# Altium project NG2093.PrjPcb (part 1 of 10)
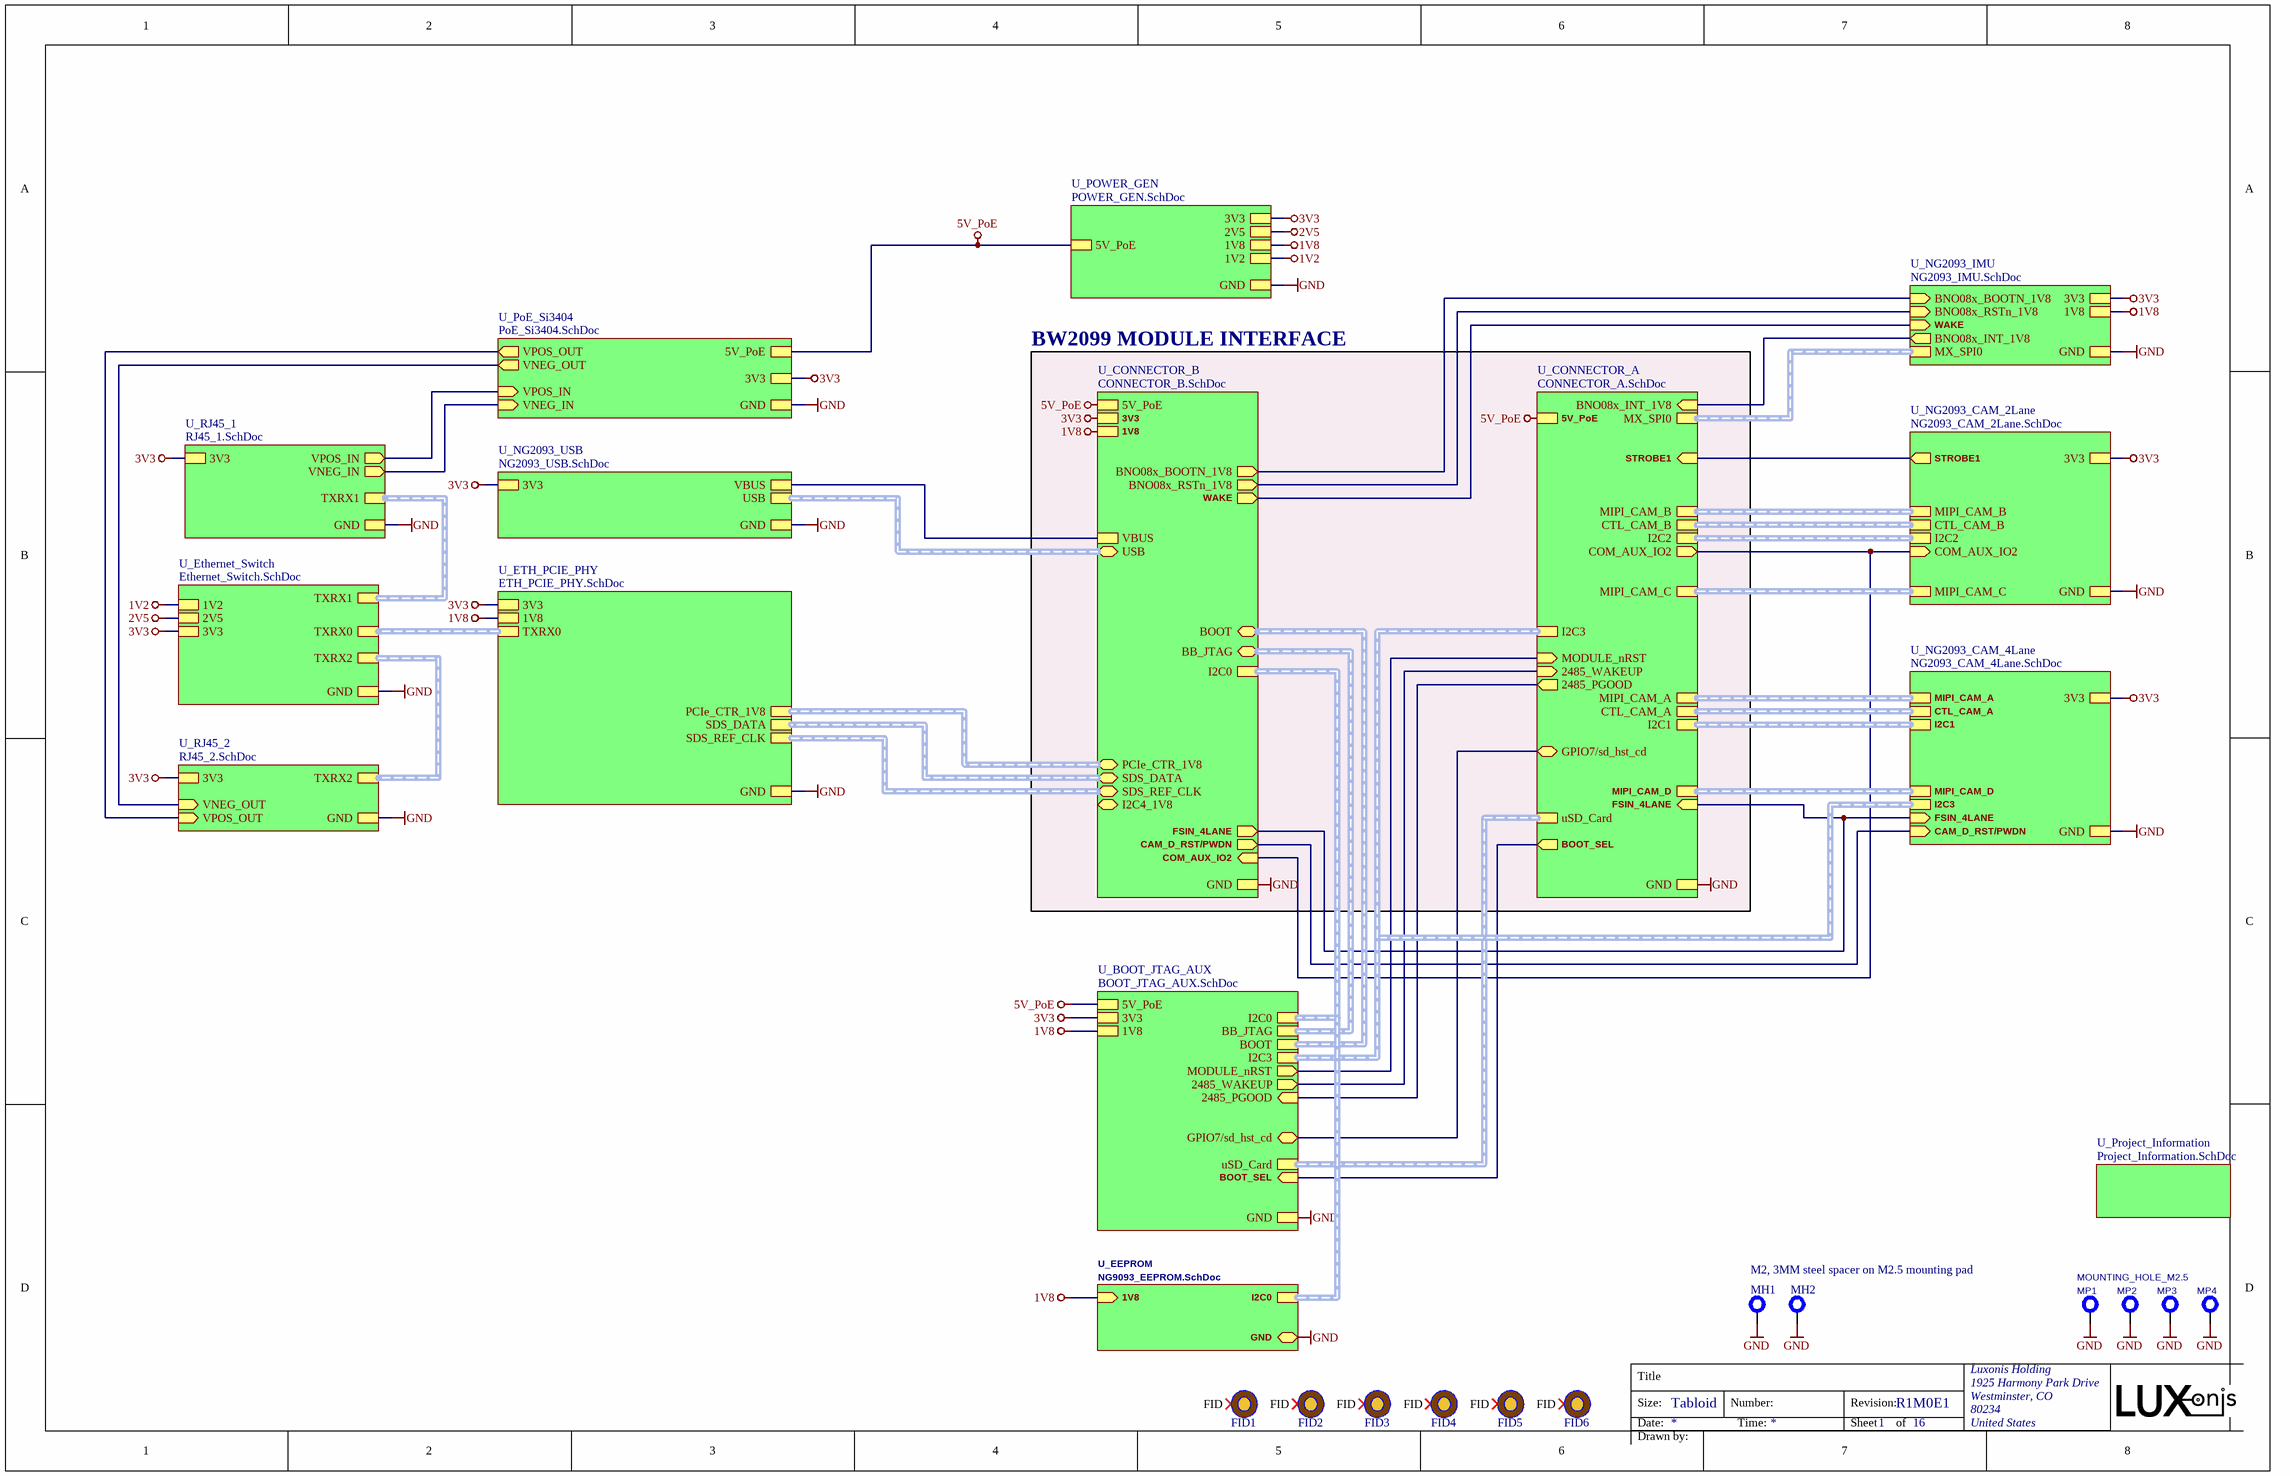
[diagram p0: TopLevel.SchDoc]
drawn_by: Nejc Gostincar; project_title: NG2093; rev: R1M0E1
16 sheets, 379 parts. Net scope: strictly hierarchical (ports join the sheet entries above them; power ports are local).
Board file: NG2093.PcbDoc
Sheets:
  TopLevel.SchDoc
    U_Project_Information = Project_Information.SchDoc
    U_CONNECTOR_B = CONNECTOR_B.SchDoc
    U_CONNECTOR_A = CONNECTOR_A.SchDoc
    U_ETH_PCIE_PHY = ETH_PCIE_PHY.SchDoc
    U_NG2093_USB = NG2093_USB.SchDoc
    U_BOOT_JTAG_AUX = BOOT_JTAG_AUX.SchDoc
    U_POWER_GEN = POWER_GEN.SchDoc
    U_NG2093_IMU = NG2093_IMU.SchDoc
    U_RJ45_1 = RJ45_1.SchDoc
    U_RJ45_2 = RJ45_2.SchDoc
    U_NG2093_CAM_2Lane = NG2093_CAM_2Lane.SchDoc
    U_Ethernet_Switch = Ethernet_Switch.SchDoc
    U_PoE_Si3404 = PoE_Si3404.SchDoc
    U_NG2093_CAM_4Lane = NG2093_CAM_4Lane.SchDoc
    U_EEPROM = NG9093_EEPROM.SchDoc

## Sheet TopLevel.SchDoc: =project_title
size Tabloid; CompanyName: Luxonis Holding; DrawnBy: Nejc Gostincar; Organization: Luxonis Holding; Address1: 1925 Harmony Park Drive; Address2: Westminster, CO; Address3: 80234; Address4: United States; SheetNumber: 1; SheetTotal: 16

### Parts
FID1  FIDUCIAL_ROUND_1MM  [FIDUCIAL_ROUND_1MM]  (value not drawn)  (no BOM)
FID2  FIDUCIAL_ROUND_1MM  [FIDUCIAL_ROUND_1MM]  (value not drawn)  (no BOM)
FID3  FIDUCIAL_ROUND_1MM  [FIDUCIAL_ROUND_1MM]  (value not drawn)  (no BOM)
FID4  FIDUCIAL_ROUND_1MM  [FIDUCIAL_ROUND_1MM]  (value not drawn)  (no BOM)
FID5  FIDUCIAL_ROUND_1MM  [FIDUCIAL_ROUND_1MM]  (value not drawn)  (no BOM)
FID6  FIDUCIAL_ROUND_1MM  [FIDUCIAL_ROUND_1MM]  (value not drawn)  (no BOM)
MH1  M2, 3MM steel spacer on M2.5 mounting pad  [9774030243R]
MH2  M2, 3MM steel spacer on M2.5 mounting pad  [9774030243R]  (value not drawn)
MP1  MOUNTING_HOLE_M2.5  [MOUNTING_HOLE_M2.5]  (no BOM)
MP2  MOUNTING_HOLE_M2.5  [MOUNTING_HOLE_M2.5]  (value not drawn)  (no BOM)
MP3  MOUNTING_HOLE_M2.5  [MOUNTING_HOLE_M2.5]  (value not drawn)  (no BOM)
MP4  MOUNTING_HOLE_M2.5  [MOUNTING_HOLE_M2.5]  (value not drawn)  (no BOM)

### Sub-sheets
U_BOOT_JTAG_AUX = BOOT_JTAG_AUX.SchDoc: BOOT (harness BOOT), BB_JTAG (harness BB_JTAG), uSD_Card (harness uSD_Card), 2485_WAKEUP (out), I2C3 (harness I2C3), MODULE_nRST (out), 2485_PGOOD (in), 1V8, 3V3, GND, 5V_PoE, I2C0 (harness I2C0), GPIO7/sd_hst_cd (bidir), BOOT_SEL (in)
U_CONNECTOR_A = CONNECTOR_A.SchDoc: I2C2 (harness I2C2), I2C1 (harness I2C1), uSD_Card (harness uSD_Card), MIPI_CAM_C (harness MIPI_CAM_C), CTL_CAM_A (harness CTL_CAM_A), MIPI_CAM_A (harness MIPI_CAM_A), MIPI_CAM_B (harness MIPI_CAM_B), GND, I2C3 (harness I2C3), CTL_CAM_B (harness CTL_CAM_B), COM_AUX_IO2 (out), MODULE_nRST (in), 2485_WAKEUP (in), 2485_PGOOD (out), GPIO7/sd_hst_cd (bidir), BNO08x_INT_1V8 (in), MX_SPI0 (harness MX_SPI0), MIPI_CAM_D (harness MIPI_CAM_D), STROBE1 (in), FSIN_4LANE (in), BOOT_SEL (out), 5V_PoE
U_CONNECTOR_B = CONNECTOR_B.SchDoc: VBUS, I2C0 (harness I2C0), 5V_PoE, GND, BOOT (bidir, harness BOOT), PCIe_CTR_1V8 (bidir, harness PCIe_CTR_1V8), BB_JTAG (bidir, harness BB_JTAG), USB (bidir, harness USB), SDS_REF_CLK (bidir, harness SDS_REF_CLK), I2C4_1V8 (bidir, harness I2C4_1V8), SDS_DATA (bidir, harness Harness), BNO08x_BOOTN_1V8 (out), BNO08x_RSTn_1V8 (out), FSIN_4LANE (out), CAM_D_RST/PWDN (out), COM_AUX_IO2 (in), 3V3, 1V8, WAKE (out)
U_EEPROM = NG9093_EEPROM.SchDoc: GND (bidir), 1V8 (in), I2C0 (harness I2C0)
U_ETH_PCIE_PHY = ETH_PCIE_PHY.SchDoc: TXRX0 (harness RTL8111), SDS_DATA (harness Harness), 3V3, GND, SDS_REF_CLK (harness SDS_REF_CLK), 1V8, PCIe_CTR_1V8 (harness PCIe_CTR_1V8)
U_Ethernet_Switch = Ethernet_Switch.SchDoc: TXRX2 (harness RJ45_2), TXRX0 (harness RTL8111), TXRX1 (harness RJ45_1), GND, 3V3, 2V5, 1V2
U_NG2093_CAM_2Lane = NG2093_CAM_2Lane.SchDoc: MIPI_CAM_B (harness MIPI_CAM_B), I2C2 (harness I2C2), MIPI_CAM_C (harness MIPI_CAM_C), GND, 3V3, COM_AUX_IO2 (in), CTL_CAM_B (harness CTL_CAM_B), STROBE1 (out)
U_NG2093_CAM_4Lane = NG2093_CAM_4Lane.SchDoc: GND, 3V3, MIPI_CAM_D (harness MIPI_CAM_D), CTL_CAM_A (harness CTL_CAM_A), MIPI_CAM_A (harness MIPI_CAM_A), CAM_D_RST/PWDN (in), I2C3 (harness I2C3), FSIN_4LANE (in), I2C1 (harness I2C1)
U_NG2093_IMU = NG2093_IMU.SchDoc: BNO08x_BOOTN_1V8 (in), GND, 3V3, BNO08x_INT_1V8 (out), BNO08x_RSTn_1V8 (in), 1V8, MX_SPI0 (harness MX_SPI0), WAKE (in)
U_NG2093_USB = NG2093_USB.SchDoc: USB (harness USB), GND, 3V3, VBUS
U_PoE_Si3404 = PoE_Si3404.SchDoc: 5V_PoE, GND, VPOS_IN (in), VNEG_IN (in), VNEG_OUT (out), VPOS_OUT (out), 3V3
U_POWER_GEN = POWER_GEN.SchDoc: GND, 3V3, 1V8, 5V_PoE, 1V2, 2V5
U_Project_Information = Project_Information.SchDoc: no entries
U_RJ45_1 = RJ45_1.SchDoc: GND, 3V3, VPOS_IN (out), VNEG_IN (out), TXRX1 (harness RJ45_1)
U_RJ45_2 = RJ45_2.SchDoc: GND, 3V3, VNEG_OUT (in), VPOS_OUT (in), TXRX2 (harness RJ45_2)

### Nets
1V2: sheet U_POWER_GEN/1V2, sheet U_Ethernet_Switch/1V2
1V8: sheet U_CONNECTOR_B/1V8, sheet U_ETH_PCIE_PHY/1V8, sheet U_BOOT_JTAG_AUX/1V8, sheet U_POWER_GEN/1V8, sheet U_NG2093_IMU/1V8, sheet U_EEPROM/1V8
2V5: sheet U_POWER_GEN/2V5, sheet U_Ethernet_Switch/2V5
3V3: sheet U_CONNECTOR_B/3V3, sheet U_ETH_PCIE_PHY/3V3, sheet U_NG2093_USB/3V3, sheet U_BOOT_JTAG_AUX/3V3, sheet U_POWER_GEN/3V3, sheet U_NG2093_IMU/3V3, sheet U_RJ45_1/3V3, sheet U_RJ45_2/3V3, sheet U_NG2093_CAM_2Lane/3V3, sheet U_Ethernet_Switch/3V3, sheet U_PoE_Si3404/3V3, sheet U_NG2093_CAM_4Lane/3V3
5V_PoE: sheet U_CONNECTOR_B/5V_PoE, sheet U_CONNECTOR_A/5V_PoE, sheet U_BOOT_JTAG_AUX/5V_PoE, sheet U_POWER_GEN/5V_PoE, sheet U_PoE_Si3404/5V_PoE
GND: MH1.1 MH2.1 MP1.1 MP2.1 MP3.1 MP4.1 ; sheet U_CONNECTOR_B/GND, sheet U_CONNECTOR_A/GND, sheet U_ETH_PCIE_PHY/GND, sheet U_NG2093_USB/GND, sheet U_BOOT_JTAG_AUX/GND, sheet U_POWER_GEN/GND, sheet U_NG2093_IMU/GND, sheet U_RJ45_1/GND, sheet U_RJ45_2/GND, sheet U_NG2093_CAM_2Lane/GND, sheet U_Ethernet_Switch/GND, sheet U_PoE_Si3404/GND, sheet U_NG2093_CAM_4Lane/GND, sheet U_EEPROM/GND
VBUS: sheet U_CONNECTOR_B/VBUS, sheet U_NG2093_USB/VBUS
VNEG_IN: sheet U_RJ45_1/VNEG_IN, sheet U_PoE_Si3404/VNEG_IN
2485_BOOT_SEL: sheet U_CONNECTOR_A/BOOT_SEL, sheet U_BOOT_JTAG_AUX/BOOT_SEL
2485_PGOOD: sheet U_CONNECTOR_A/2485_PGOOD, sheet U_BOOT_JTAG_AUX/2485_PGOOD
2485_WAKEUP: sheet U_CONNECTOR_A/2485_WAKEUP, sheet U_BOOT_JTAG_AUX/2485_WAKEUP
BNO08x_BOOTN_1V8: sheet U_CONNECTOR_B/BNO08x_BOOTN_1V8, sheet U_NG2093_IMU/BNO08x_BOOTN_1V8
BNO08x_INT_1V8: sheet U_CONNECTOR_A/BNO08x_INT_1V8, sheet U_NG2093_IMU/BNO08x_INT_1V8
BNO08x_RSTn_1V8: sheet U_CONNECTOR_B/BNO08x_RSTn_1V8, sheet U_NG2093_IMU/BNO08x_RSTn_1V8
CAM2_RST: sheet U_CONNECTOR_B/CAM_D_RST/PWDN, sheet U_NG2093_CAM_4Lane/CAM_D_RST/PWDN
COM_AUX_IO2: sheet U_CONNECTOR_B/COM_AUX_IO2, sheet U_CONNECTOR_A/COM_AUX_IO2, sheet U_NG2093_CAM_2Lane/COM_AUX_IO2
FSIN_4LANE: sheet U_CONNECTOR_B/FSIN_4LANE, sheet U_CONNECTOR_A/FSIN_4LANE, sheet U_NG2093_CAM_4Lane/FSIN_4LANE
GPIO7/sd_hst_cd: sheet U_CONNECTOR_A/GPIO7/sd_hst_cd, sheet U_BOOT_JTAG_AUX/GPIO7/sd_hst_cd
MODULE_nRST: sheet U_CONNECTOR_A/MODULE_nRST, sheet U_BOOT_JTAG_AUX/MODULE_nRST
STROBE1: sheet U_CONNECTOR_A/STROBE1, sheet U_NG2093_CAM_2Lane/STROBE1
VNEG_OUT: sheet U_RJ45_2/VNEG_OUT, sheet U_PoE_Si3404/VNEG_OUT
VPOS_IN: sheet U_RJ45_1/VPOS_IN, sheet U_PoE_Si3404/VPOS_IN
VPOS_OUT: sheet U_RJ45_2/VPOS_OUT, sheet U_PoE_Si3404/VPOS_OUT
WAKE: sheet U_CONNECTOR_B/WAKE, sheet U_NG2093_IMU/WAKE

Not connected (* = marked no-connect by the designer): FID1 FID*; FID2 FID*; FID3 FID*; FID4 FID*; FID5 FID*; FID6 FID*

### Buses and harness runs
harness sheet U_BOOT_JTAG_AUX/BB_JTAG = sheet U_CONNECTOR_B/BB_JTAG
harness sheet U_BOOT_JTAG_AUX/BOOT = sheet U_CONNECTOR_B/BOOT
harness sheet U_BOOT_JTAG_AUX/I2C0 = sheet U_CONNECTOR_B/I2C0 = sheet U_EEPROM/I2C0
harness sheet U_BOOT_JTAG_AUX/I2C3 = sheet U_CONNECTOR_A/I2C3 = sheet U_NG2093_CAM_4Lane/I2C3
harness sheet U_BOOT_JTAG_AUX/uSD_Card = sheet U_CONNECTOR_A/uSD_Card
harness sheet U_CONNECTOR_A/CTL_CAM_A = sheet U_NG2093_CAM_4Lane/CTL_CAM_A
harness sheet U_CONNECTOR_A/CTL_CAM_B = sheet U_NG2093_CAM_2Lane/CTL_CAM_B
harness sheet U_CONNECTOR_A/I2C1 = sheet U_NG2093_CAM_4Lane/I2C1
harness sheet U_CONNECTOR_A/I2C2 = sheet U_NG2093_CAM_2Lane/I2C2
harness sheet U_CONNECTOR_A/MIPI_CAM_A = sheet U_NG2093_CAM_4Lane/MIPI_CAM_A
harness sheet U_CONNECTOR_A/MIPI_CAM_B = sheet U_NG2093_CAM_2Lane/MIPI_CAM_B
harness sheet U_CONNECTOR_A/MIPI_CAM_C = sheet U_NG2093_CAM_2Lane/MIPI_CAM_C
harness sheet U_CONNECTOR_A/MIPI_CAM_D = sheet U_NG2093_CAM_4Lane/MIPI_CAM_D
harness sheet U_CONNECTOR_A/MX_SPI0 = sheet U_NG2093_IMU/MX_SPI0
harness sheet U_CONNECTOR_B/PCIe_CTR_1V8 = sheet U_ETH_PCIE_PHY/PCIe_CTR_1V8
harness sheet U_CONNECTOR_B/SDS_DATA = sheet U_ETH_PCIE_PHY/SDS_DATA
harness sheet U_CONNECTOR_B/SDS_REF_CLK = sheet U_ETH_PCIE_PHY/SDS_REF_CLK
harness sheet U_CONNECTOR_B/USB = sheet U_NG2093_USB/USB
harness sheet U_ETH_PCIE_PHY/TXRX0 = sheet U_Ethernet_Switch/TXRX0
harness sheet U_Ethernet_Switch/TXRX1 = sheet U_RJ45_1/TXRX1
harness sheet U_Ethernet_Switch/TXRX2 = sheet U_RJ45_2/TXRX2

### Notes on the sheet
- BW2099 MODULE INTERFACE
- Title
- Size:
- Date:
- Tabloid
- Number:
- Time:
- Revision:
- Sheet
- of
- Drawn by:

### Library data of the parts
FID1-FID6 = FIDUCIAL: Fiducial with various available footprints
MH1 MH2 = 9774030243R: MP ROUND STANDOFF M2X0.4 STEEL 3MM; Manufacturer 1: Wurth Electronics; Plating: Tin; Threaded/Unthreaded: Threaded; Outside Diameter: 0.171inch; Supplier 1: Digi-Key; Manufacturer Part Number 1: 9774030243R; Stock 1: 20568; Pricing 1: 1=0.95000, 10=0.91800, 50=0.79500, 100=0.73900 (USD); RoHS: Yes; Material: Steel; Length: 0.173inch; REACH SVHC: Unknown; ComponentLink1URL: http://www.mouser.com/ds/2/445/9774030243R-611455.pdf?src-supplier=Mouser; ComponentLink1Description: http://www.mouser.com/ds/2/445/9774030243R-611455.pdf?src-supplier=Mouser; ComponentLink2URL: http://www.farnell.com/datasheets/1960368.pdf?src-supplier=Farnell; ComponentLink2Description: http://www.farnell.com/datasheets/1960368.pdf?src-supplier=Farnell; ComponentLink3URL: https://katalog.we-online.de/em/datasheet/9774030243R.pdf?src-supplier=Digi-Key; ComponentLink3Description: https://katalog.we-online.de/em/datasheet/9774030243R.pdf?src-supplier=Digi-Key; ComponentLink4URL: http://www.farnell.com/datasheets/1960368.pdf?src-supplier=Newark; ComponentLink4Description: http://www.farnell.com/datasheets/1960368.pdf?src-supplier=Newark; ComponentLink5URL: http://www.farnell.com/datasheets/1960368.pdf?src-supplier=Element14; ComponentLink5Description: http://www.farnell.com/datasheets/1960368.pdf?src-supplier=Element14; Supplier Part Number 1: 732-7085-1-ND; Supplier 2: Mouser; Supplier Part Number 2: 710-9774030243R; Supplier 3: Element14; Supplier Part Number 3: 2497599
MP1-MP4 = MP_Mounting-Holes: =CurrentFootprint; B - Value: Not a Part; A - Level: 0

## Sheet Project_Information.SchDoc: =project_title
size Tabloid; CompanyName: Luxonis Holding; DrawnBy: Nejc Gostincar; Organization: Luxonis Holding; Address1: 1925 Harmony Park Drive; Address2: Westminster, CO; Address3: 80234; Address4: United States; Revision: R1M0E1; SheetNumber: 2; SheetTotal: 16
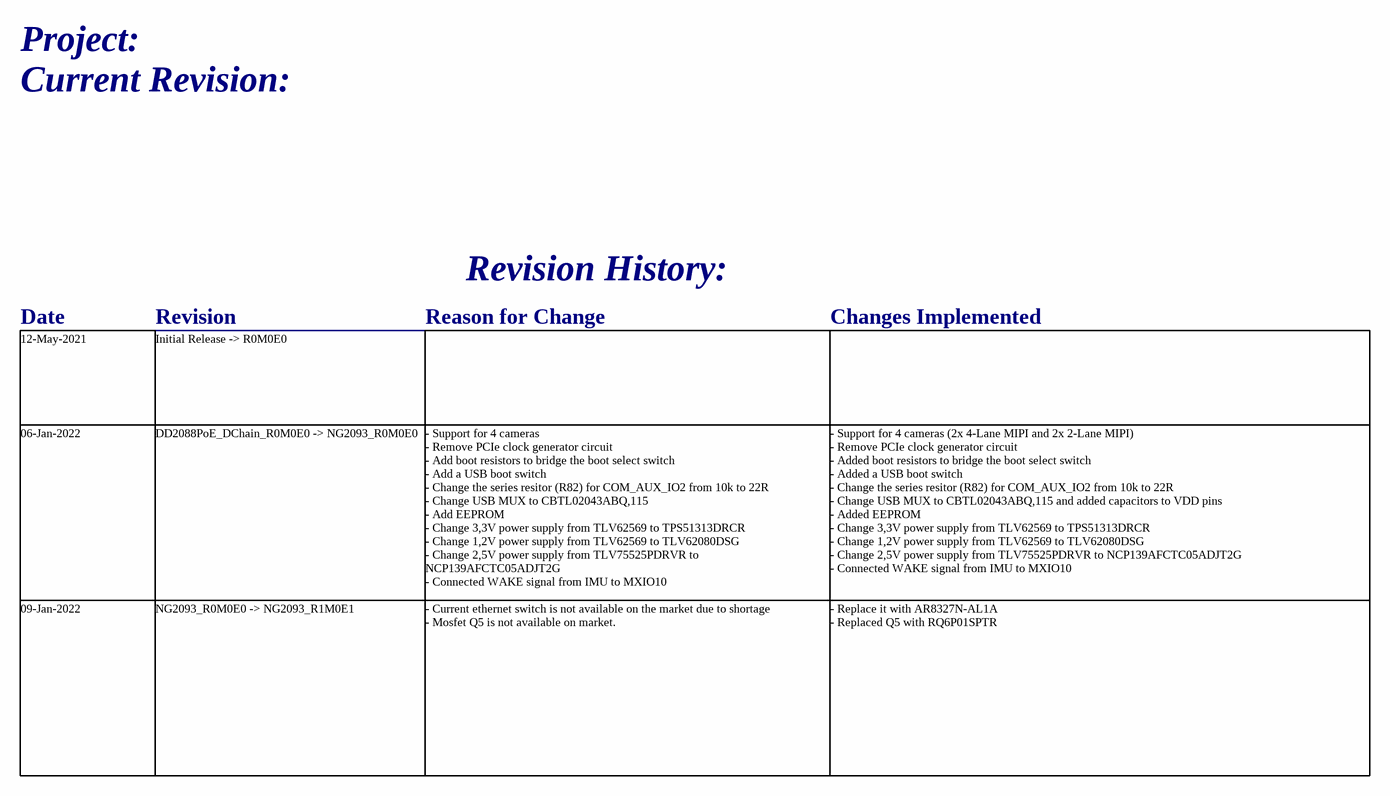
[diagram p1: Project_Information.SchDoc]

### Notes on the sheet
- Project:
- Current Revision:
- Revision History:
- Date
- Revision
- Reason for Change
- Changes Implemented
- 12-May-2021
- Initial Release -> R0M0E0
- 06-Jan-2022
- DD2088PoE_DChain_R0M0E0 -> NG2093_R0M0E0
- - Support for 4 cameras
  - Remove PCIe clock generator circuit
  - Add boot resistors to bridge the boot select switch
  - Add a USB boot switch
  - Change the series resitor (R82) for COM_AUX_IO2 from 10k to 22R
  - Change USB MUX to CBTL02043ABQ,115
  - Add EEPROM
  - Change 3,3V power supply from TLV62569 to TPS51313DRCR
  - Change 1,2V power supply from TLV62569 to TLV62080DSG
  - Change 2,5V power supply from TLV75525PDRVR to NCP139AFCTC05ADJT2G
  - Connected WAKE signal from IMU to MXIO10
- - Support for 4 cameras (2x 4-Lane MIPI and 2x 2-Lane MIPI)
  - Remove PCIe clock generator circuit
  - Added boot resistors to bridge the boot select switch
  - Added a USB boot switch
  - Change the series resitor (R82) for COM_AUX_IO2 from 10k to 22R
  - Change USB MUX to CBTL02043ABQ,115 and added capacitors to VDD pins
  - Added EEPROM
  - Change 3,3V power supply from TLV62569 to TPS51313DRCR
  - Change 1,2V power supply from TLV62569 to TLV62080DSG
  - Change 2,5V power supply from TLV75525PDRVR to NCP139AFCTC05ADJT2G
  - Connected WAKE signal from IMU to MXIO10
- 09-Jan-2022
- NG2093_R0M0E0 -> NG2093_R1M0E1
- - Current ethernet switch is not available on the market due to shortage
  - Mosfet Q5 is not available on market.
- - Replace it with AR8327N-AL1A
  - Replaced Q5 with RQ6P01SPTR
- Title
- Size:
- Date:
- Tabloid
- Number:
- Time:
- Revision:
- Sheet
- of
- Drawn by:

## Sheet CONNECTOR_B.SchDoc: =project_title
size Tabloid; CompanyName: Luxonis Holding; DrawnBy: Nejc Gostincar; Organization: Luxonis Holding; Address1: 1925 Harmony Park Drive; Address2: Westminster, CO; Address3: 80234; Address4: United States; SheetNumber: 5; SheetTotal: 16
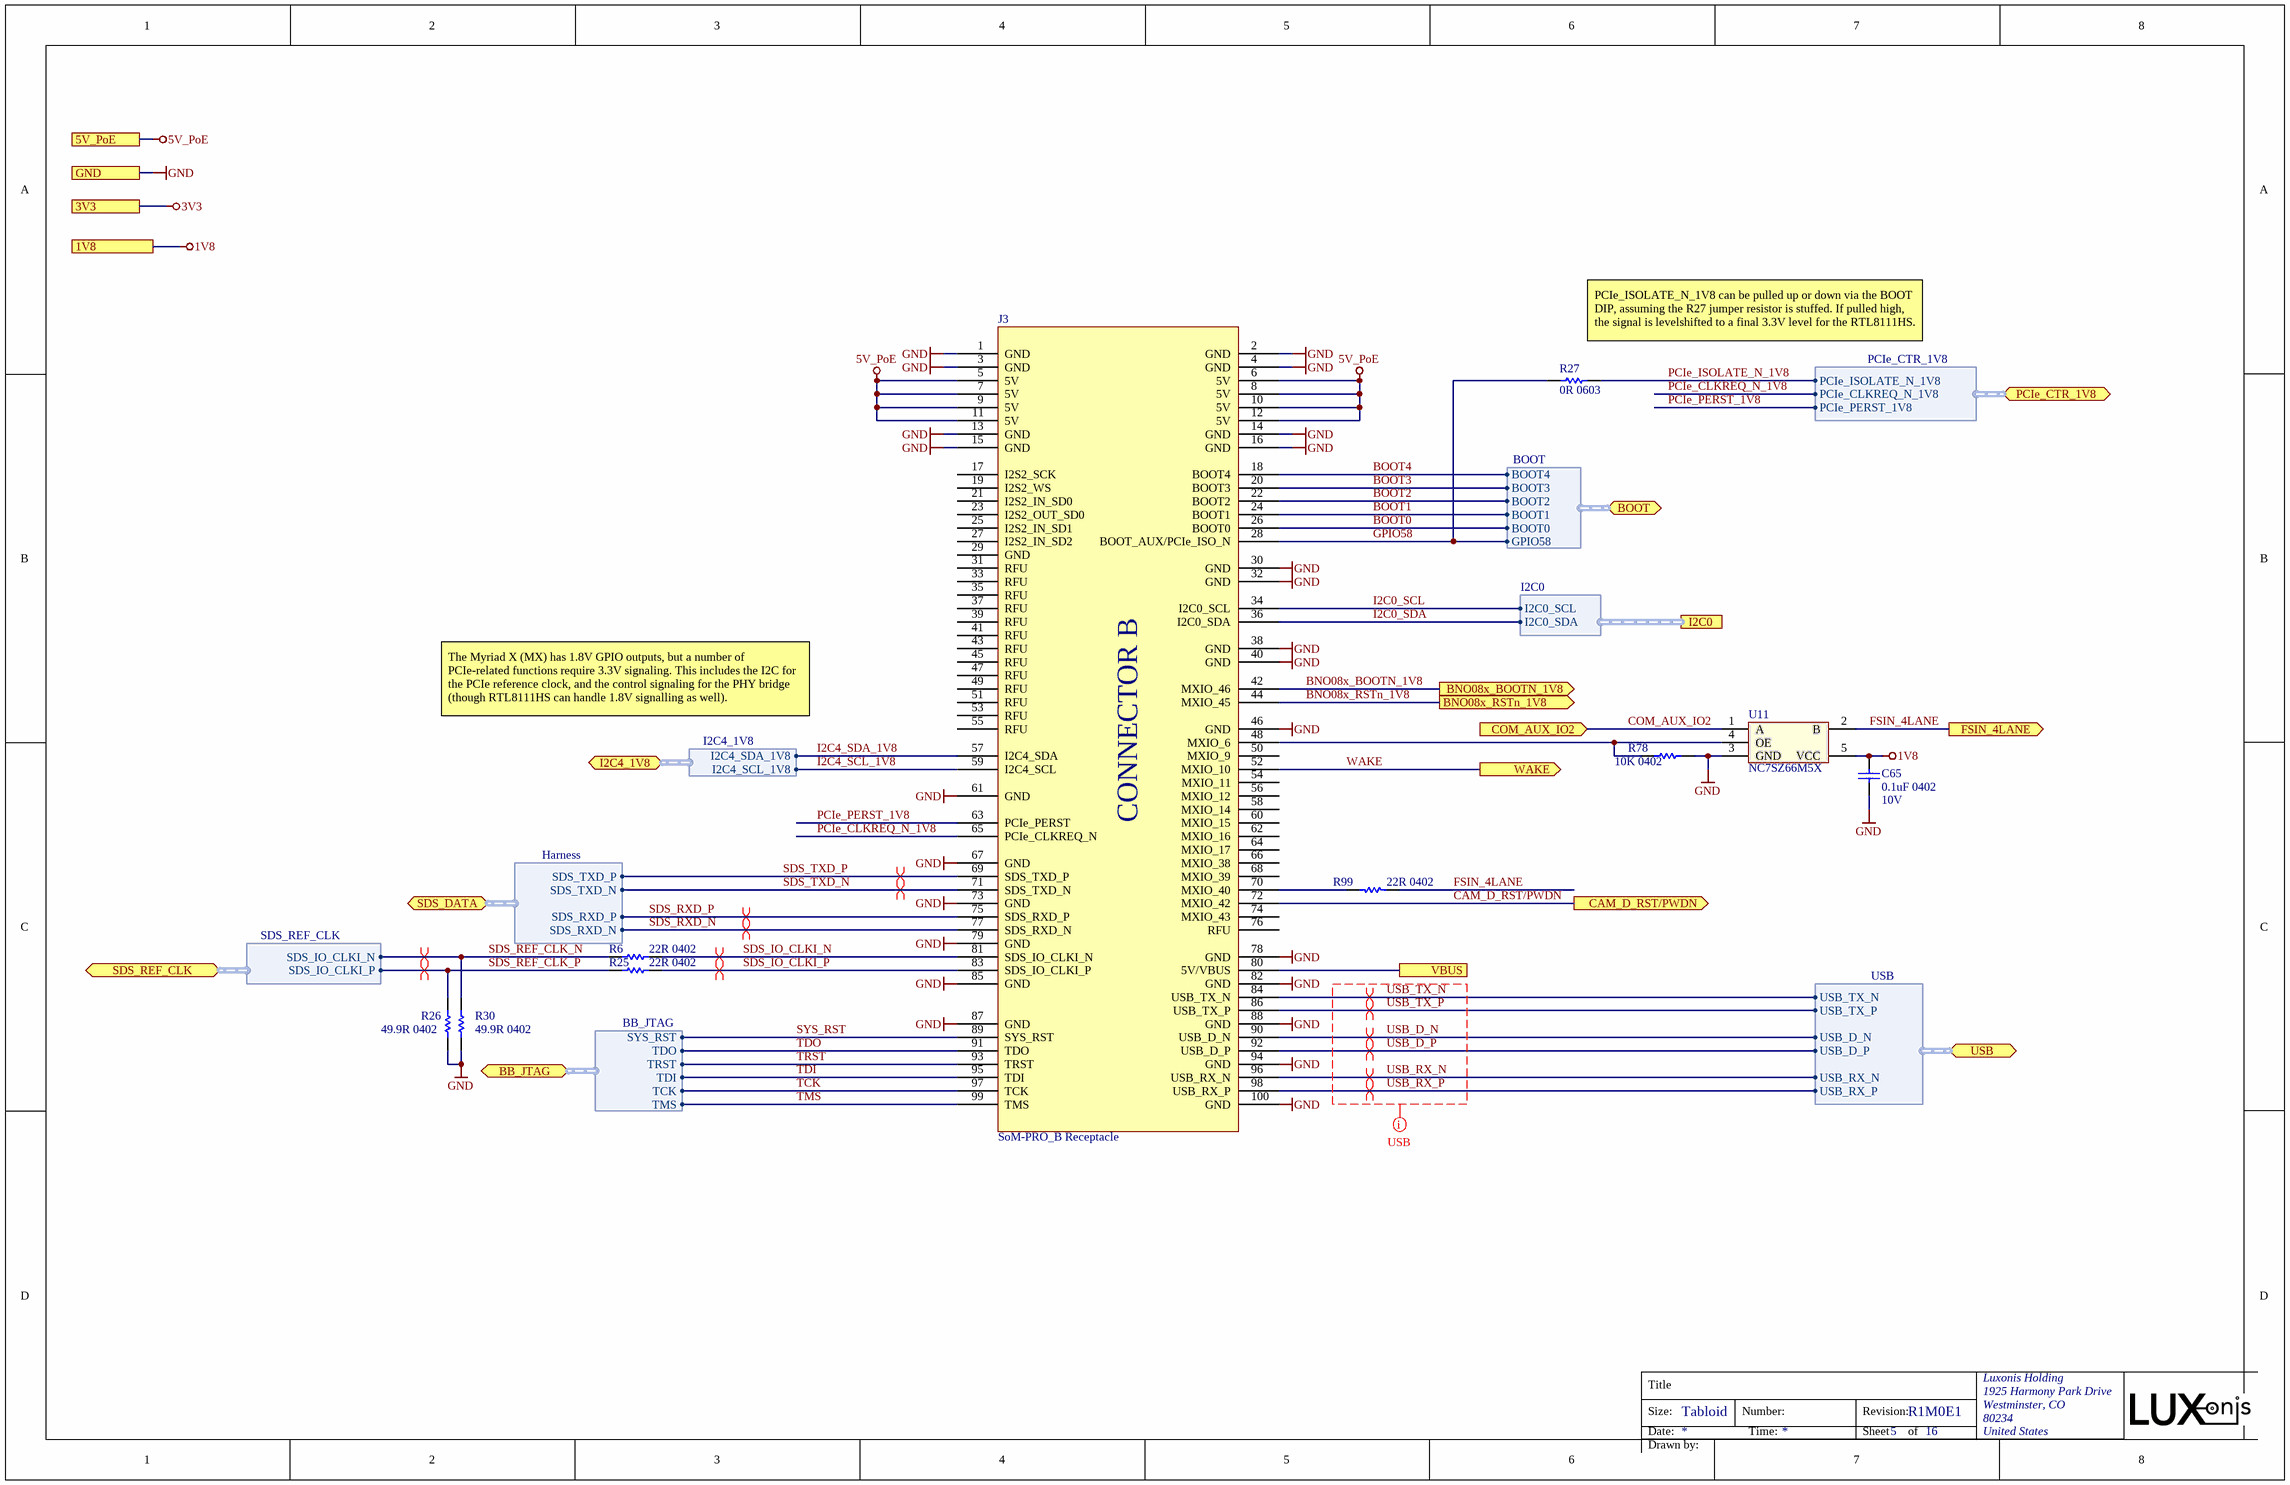
[diagram p2: CONNECTOR_B.SchDoc]

### Parts
C65  0.1uF 0402  Voltage Rating: 10V  [CAPC0402(1005)70_L]
J3  SoM-PRO_B Receptacle  [CON_B_BW2099_SoM_DF40HC-3.0-100DS-0.4V_minpad]
R6  22R 0402  [RESC0402(1005)_L]
R25  22R 0402  [RESC0402(1005)_L]
R26  49.9R 0402  [RESC0402(1005)_L]
R27  0R 0603  [RESC0603(1608)_N]
R30  49.9R 0402  [RESC0402(1005)_L]
R78  10K 0402  [RESC0402(1005)_L]
R99  22R 0402  [RESC0402(1005)_L]
U11  NC7SZ66M5X  [SOT235]

### Ports
1V8, 3V3, 5V_PoE, BB_JTAG (bidir, harness BB_JTAG), BNO08x_BOOTN_1V8 (out), BNO08x_RSTn_1V8 (out), BOOT (bidir, harness BOOT), CAM_D_RST/PWDN (out), COM_AUX_IO2 (in), FSIN_4LANE (out), GND, I2C0 (harness I2C0), I2C4_1V8 (bidir, harness I2C4_1V8), PCIe_CTR_1V8 (bidir, harness PCIe_CTR_1V8), SDS_DATA (bidir, harness Harness), SDS_REF_CLK (bidir, harness SDS_REF_CLK), USB (bidir, harness USB), VBUS, WAKE (out)

### Harnesses
USB: USB_RX_P, USB_RX_N, USB_D_P, USB_D_N, USB_TX_P, USB_TX_N
BOOT: BOOT4, BOOT3, BOOT2, BOOT1, BOOT0, GPIO58
I2C0: I2C0_SDA, I2C0_SCL
BB_JTAG: SYS_RST, TDO, TRST, TDI, TCK, TMS
SDS_REF_CLK: SDS_IO_CLKI_P, SDS_IO_CLKI_N
Harness: SDS_TXD_P, SDS_TXD_N, SDS_RXD_P, SDS_RXD_N
I2C4_1V8: I2C4_SDA_1V8, I2C4_SCL_1V8
PCIe_CTR_1V8: PCIe_CLKREQ_N_1V8, PCIe_ISOLATE_N_1V8, PCIe_PERST_1V8

### Nets
1V8: C65.2 U11.5(VCC) ; port 1V8
5V_PoE: J3.5(5V) J3.6(5V) J3.7(5V) J3.8(5V) J3.9(5V) J3.10(5V) J3.11(5V) J3.12(5V) ; port 5V_PoE
GND: C65.1 J3.1(GND) J3.2(GND) J3.3(GND) J3.4(GND) J3.13(GND) J3.14(GND) J3.15(GND) J3.16(GND) J3.30(GND) J3.32(GND) J3.38(GND) J3.40(GND) J3.46(GND) J3.61(GND) J3.67(GND) J3.73(GND) J3.78(GND) J3.79(GND) J3.82(GND) J3.85(GND) J3.87(GND) J3.88(GND) J3.94(GND) J3.100(GND) R26.1 R30.2 R78.1 U11.3(GND) ; port GND
VBUS: J3.80(5V/VBUS) ; port VBUS
BNO08x_BOOTN_1V8: J3.42(MXIO_46) ; port BNO08x_BOOTN_1V8
BNO08x_RSTn_1V8: J3.44(MXIO_45) ; port BNO08x_RSTn_1V8
BOOT0: J3.26(BOOT0) ; port BOOT.BOOT0
BOOT1: J3.24(BOOT1) ; port BOOT.BOOT1
BOOT2: J3.22(BOOT2) ; port BOOT.BOOT2
BOOT3: J3.20(BOOT3) ; port BOOT.BOOT3
BOOT4: J3.18(BOOT4) ; port BOOT.BOOT4
CAM_D_RST/PWDN: J3.72(MXIO_42) ; port CAM_D_RST/PWDN  [project net CAM2_RST]
COM_AUX_IO2: U11.1(A) ; port COM_AUX_IO2
FSIN_4LANE: R99.1 U11.2(B) ; port FSIN_4LANE
GPIO58: J3.28(BOOT_AUX/PCIe_ISO_N) R27.1 ; port BOOT.GPIO58
I2C0_SCL: J3.34(I2C0_SCL) ; port I2C0.I2C0_SCL
I2C0_SDA: J3.36(I2C0_SDA) ; port I2C0.I2C0_SDA
I2C4_SCL_1V8: J3.59(I2C4_SCL) ; port I2C4_1V8.I2C4_SCL_1V8
I2C4_SDA_1V8: J3.57(I2C4_SDA) ; port I2C4_1V8.I2C4_SDA_1V8
PCIe_CLKREQ_N_1V8: J3.65(PCIe_CLKREQ_N) ; port PCIe_CTR_1V8.PCIe_CLKREQ_N_1V8
PCIe_ISOLATE_N_1V8: R27.2 ; port PCIe_CTR_1V8.PCIe_ISOLATE_N_1V8
PCIe_PERST_1V8: J3.63(PCIe_PERST) ; port PCIe_CTR_1V8.PCIe_PERST_1V8
SDS_IO_CLKI_N: J3.81(SDS_IO_CLKI_N) R6.2
SDS_IO_CLKI_P: J3.83(SDS_IO_CLKI_P) R25.2
SDS_REF_CLK_N: R6.1 R30.1 ; port SDS_REF_CLK.SDS_IO_CLKI_N
SDS_REF_CLK_P: R25.1 R26.2 ; port SDS_REF_CLK.SDS_IO_CLKI_P
SDS_RXD_N: J3.77(SDS_RXD_N) ; port SDS_DATA.SDS_RXD_N
SDS_RXD_P: J3.75(SDS_RXD_P) ; port SDS_DATA.SDS_RXD_P
SDS_TXD_N: J3.71(SDS_TXD_N) ; port SDS_DATA.SDS_TXD_N
SDS_TXD_P: J3.69(SDS_TXD_P) ; port SDS_DATA.SDS_TXD_P
SYS_RST: J3.89(SYS_RST) ; port BB_JTAG.SYS_RST
TCK: J3.97(TCK) ; port BB_JTAG.TCK
TDI: J3.95(TDI) ; port BB_JTAG.TDI
TDO: J3.91(TDO) ; port BB_JTAG.TDO
TMS: J3.99(TMS) ; port BB_JTAG.TMS
TRST: J3.93(TRST) ; port BB_JTAG.TRST
USB_D_N: J3.90(USB_D_N) ; port USB.USB_D_N
USB_D_P: J3.92(USB_D_P) ; port USB.USB_D_P
USB_RX_N: J3.96(USB_RX_N) ; port USB.USB_RX_N
USB_RX_P: J3.98(USB_RX_P) ; port USB.USB_RX_P
USB_TX_N: J3.84(USB_TX_N) ; port USB.USB_TX_N
USB_TX_P: J3.86(USB_TX_P) ; port USB.USB_TX_P
WAKE: J3.52(MXIO_10) ; port WAKE
NetJ3_48: J3.48(MXIO_6) R78.2 U11.4(OE)
NetJ3_70: J3.70(MXIO_40) R99.2

Not connected (* = marked no-connect by the designer): J3 17(I2S2_SCK) 19(I2S2_WS) 21(I2S2_IN_SD0) 23(I2S2_OUT_SD0) 25(I2S2_IN_SD1) 27(I2S2_IN_SD2) 29(GND) 31(RFU) 33(RFU) 35(RFU) 37(RFU) 39(RFU) 41(RFU) 43(RFU) 45(RFU) 47(RFU) 49(RFU) 50(MXIO_9) 51(RFU) 53(RFU) 54(MXIO_11) 55(RFU) 56(MXIO_12) 58(MXIO_14) 60(MXIO_15) 62(MXIO_16) 64(MXIO_17) 66(MXIO_38) 68(MXIO_39) 74(MXIO_43) 76(RFU)

### Layout directives
net class USB: USB_D_N, USB_D_P, USB_RX_N, USB_RX_P, USB_TX_N, USB_TX_P
differential pair; differential pair class 100ohm: SDS_IO_CLKI_N, SDS_IO_CLKI_P, SDS_REF_CLK_N, SDS_REF_CLK_P, SDS_RXD_N, SDS_RXD_P, SDS_TXD_N, SDS_TXD_P
differential pair; differential pair class USB3: USB_D_N, USB_D_P, USB_RX_N, USB_RX_P, USB_TX_N, USB_TX_P

### Notes on the sheet
- PCIe_ISOLATE_N is wired up on the MV0247 via GPIO58, but does not exist in the MV0235 design.
- (near R27) PCIe_ISOLATE_N_1V8 can be pulled up or down via the BOOT DIP, assuming the R27 jumper resistor is stuffed. If pulled high, the signal is levelshifted to a final 3.3V level for the RTL8111HS.
- The Myriad X (MX) has 1.8V GPIO outputs, but a number of PCIe-related functions require 3.3V signaling. This includes the I2C for the PCIe reference clock, and the control signaling for the PHY bridge (though RTL8111HS can handle 1.8V signalling as well).
- Title
- Size:
- Date:
- Tabloid
- Number:
- Time:
- Revision:
- Sheet
- of
- Drawn by:
- (in symbol DF40HC(3.0)-100DS-0.4V_SoM-PRO_B) CONNECTOR B

### Library data of the parts
C65 = GRM155R71A104JA01D: CAP CER 0.1UF 10V X7R 0402 5%; Manufacturer 1: Murata; Capacitance: 100nF; Supplier 1: Digi-Key; Manufacturer Part Number 1: GRM155R71A104JA01D; Stock 1: 1346709; Pricing 1: 1=0.10000, 10=0.02500, 100=0.01130, 500=0.00806, 1000=0.00633, 2500=0.00575, 5000=0.00529 (USD); RoHS: Yes; Mount: Surface Mount; Case/Package: 0402; Case Code (Imperial): 0402; Case Code (Metric): 1005; Min Operating Temperature: -55°C; Max Operating Temperature: 125°C; Tolerance: 5%; Packaging: Tape and Reel; Voltage Rating (DC): 10V; Dielectric: X7R; Package Quantity: 10000; Termination: SMD/SMT; Length: 1mm; Height: 0.5mm; Width: 0.02inch; Thickness: 0.022inch; Depth: 0.5mm; Radiation Hardening: No; Lead Free: Lead Free; ComponentLink1URL: https://datasheet.ciiva.com/5411/product-5411135.pdf?src-supplier=Mouser; ComponentLink1Description: https://datasheet.ciiva.com/5411/product-5411135.pdf?src-supplier=Mouser; ComponentLink2URL: https://datasheet.ciiva.com/11618/c02e-11618821.pdf?src-supplier=Avnet; ComponentLink2Description: https://datasheet.ciiva.com/11618/c02e-11618821.pdf?src-supplier=Avnet; Supplier Part Number 1: 490-10777-1-ND
J3 = DF40HC(3.0)-100DS-0.4V_SoM-PRO_B: CONN RCPT 100POS 0.4MM SMD GOLD; Manufacturer 1: Hirose; Manufacturer Part Number 1: DF40HC(3.0)-100DS-0.4V(58); Number of Positions: 100; Pitch: 0.016inch; System: Connector; RoHS: Yes; Mount: Surface Mount; Contact Plating: Gold; Packaging: Tape and Reel; Number of Rows: 2; Package Quantity: 1000; Connector Type: Receptacle; Lead Free: Lead Free; ComponentLink1URL: https://datasheet.ciiva.com/46636/ed-df40-20140305-46636517.pdf?src-supplier=Digi-Key; ComponentLink1Description: https://datasheet.ciiva.com/46636/ed-df40-20140305-46636517.pdf?src-supplier=Digi-Key; ComponentLink2URL: https://datasheet.ciiva.com/18562/ed-df40-20140305-18562189.pdf?src-supplier=Digi-Key; ComponentLink2Description: https://datasheet.ciiva.com/18562/ed-df40-20140305-18562189.pdf?src-supplier=Digi-Key; ComponentLink3URL: https://datasheet.ciiva.com/13559/ed-df40-20140305-13559540.pdf?src-supplier=Mouser; ComponentLink3Description: https://datasheet.ciiva.com/13559/ed-df40-20140305-13559540.pdf?src-supplier=Mouser; ComponentLink4URL: https://datasheet.ciiva.com/18562/ed-df40-20140305-18562462.pdf?src-supplier=Digi-Key; ComponentLink4Description: https://datasheet.ciiva.com/18562/ed-df40-20140305-18562462.pdf?src-supplier=Digi-Key; Supplier 1: Mouser; Stock 1: 2172; Pricing 1: 1=2.54000, 10=2.26000, 25=2.07000, 50=2.07000, 100=1.98000, 250=1.79000, 500=1.65000, 1000=1.41000, 3000=1.32000, 6000=1.23000, 10000=1.23000 (USD); Supplier 2: Mouser; Stock 2: 2078; Pricing 2: 1=2.50000, 10=2.40000, 25=2.10000, 50=2.10000, 100=2.00000, 250=1.76000, 500=1.71000, 1000=1.45000, 2000=1.36000, 5000=1.31000, 10000=1.31000 (USD); Supplier Part Number 1: 798-DF40HC30100DS451; Supplier Part Number 2: 798-DF40HC30100DS458
R6 R25 R99 = RC0402FR-0722RL: RES SMD 22 OHM 1% 1/16W 0402; Manufacturer 1: Yageo; Temperature Coefficient: 100ppm/°C; Power Rating: 63mW; Voltage Rating: 50V; Supplier 1: Digi-Key; Manufacturer Part Number 1: RC0402FR-0722RL; Stock 1: 23751364; Pricing 1: 10000=0.00163, 30000=0.00144, 50000=0.00132, 100000=0.00129 (USD); RoHS: Yes; Case/Package: 0402; Number of Pins: 2; Case Code (Metric): 1005; Case Code (Imperial): 0402; Min Operating Temperature: -55°C; Max Operating Temperature: 155°C; Tolerance: 1%; Resistance: 22R; Packaging: Tape and Reel; Composition: Thick Film; Voltage Rating (DC): 50V; Termination: SMD/SMT; Military Standard: Not; Length: 1mm; Height: 0.32mm; Width: 0.5mm; Depth: 0.5mm; REACH SVHC: Unknown; Lead Free: Lead Free; ComponentLink1URL: https://datasheet.ciiva.com/11819/0900766b80c66297-11819462.pdf?src-supplier=RSComponents; ComponentLink1Description: https://datasheet.ciiva.com/11819/0900766b80c66297-11819462.pdf?src-supplier=RSComponents; ComponentLink2URL: https://datasheet.ciiva.com/7849/1018594-7849911.pdf?src-supplier=Element14; ComponentLink2Description: https://datasheet.ciiva.com/7849/1018594-7849911.pdf?src-supplier=Element14; ComponentLink3URL: https://datasheet.ciiva.com/26829/getdatasheetpartid-554995-26829991.pdf?src-supplier=Verical; ComponentLink3Description: https://datasheet.ciiva.com/26829/getdatasheetpartid-554995-26829991.pdf?src-supplier=Verical; ComponentLink4URL: https://datasheet.ciiva.com/7849/1018594-7849912.pdf?src-supplier=Element14; ComponentLink4Description: https://datasheet.ciiva.com/7849/1018594-7849912.pdf?src-supplier=Element14; ComponentLink5URL: https://datasheet.ciiva.com/16930/pyu-rc0402-51-rohs-l-6-r-16930687.pdf?src-supplier=Future+Electronics; ComponentLink5Description: https://datasheet.ciiva.com/16930/pyu-rc0402-51-rohs-l-6-r-16930687.pdf?src-supplier=Future+Electronics; Supplier 2: Newark; Supplier 3: Mouser; Supplier Part Number 2: 26M6784; Supplier Part Number 3: 603-RC0402FR-0722RL; Supplier Part Number 1: 311-22.0LRTR-ND
R26 R30 = RC0402FR-0749R9L: RES SMD 49.9 OHM 1% 1/16W 0402; Manufacturer 1: Yageo; Power Rating: 62.5mW; Temperature Coefficient: 100ppm/°C; Voltage Rating: 50V; Max Power Dissipation: 63mW; Supplier 1: Digi-Key; Manufacturer Part Number 1: RC0402FR-0749R9L; Stock 1: 15110719; Pricing 1: 1=0.10000, 10=0.01600, 100=0.00640, 1000=0.00289, 2500=0.00251, 5000=0.00207 (USD); RoHS: Yes; Case/Package: 0402; Number of Pins: 2; Case Code (Imperial): 0402; Case Code (Metric): 1005; Min Operating Temperature: -55°C; Max Operating Temperature: 155°C; Packaging: Tape and Reel; Resistance: 49.9R; Tolerance: 1%; Composition: Thick Film; Number of Terminations: 2; Package Quantity: 1; Termination: SMD/SMT; Military Standard: Not; Voltage Rating (DC): 50V; Features: Moisture Resistant; Working Voltage: 50V; Length: 1mm; Height: 0.016inch; Width: 0.5mm; Depth: 0.5mm; Lead Free: Lead Free; REACH SVHC: No SVHC; ComponentLink1URL: https://datasheet.ciiva.com/11819/0900766b80c66297-11819508.pdf?src-supplier=RSComponents; ComponentLink1Description: https://datasheet.ciiva.com/11819/0900766b80c66297-11819508.pdf?src-supplier=RSComponents; ComponentLink2URL: https://datasheet.ciiva.com/7983/1018594-7983542.pdf?src-supplier=Element14; ComponentLink2Description: https://datasheet.ciiva.com/7983/1018594-7983542.pdf?src-supplier=Element14; ComponentLink3URL: https://datasheet.ciiva.com/16743/pyu-rc0402-51-rohs-l-6-r-16743942.pdf?src-supplier=Future+Electronics; ComponentLink3Description: https://datasheet.ciiva.com/16743/pyu-rc0402-51-rohs-l-6-r-16743942.pdf?src-supplier=Future+Electronics; ComponentLink4URL: https://datasheet.ciiva.com/22747/1018594-22747514.pdf?src-supplier=Element14; ComponentLink4Description: https://datasheet.ciiva.com/22747/1018594-22747514.pdf?src-supplier=Element14; ComponentLink5URL: https://datasheet.ciiva.com/2453/pyu-r-int-thick-7-2453355.pdf?src-supplier=Digi-Key; ComponentLink5Description: https://datasheet.ciiva.com/2453/pyu-r-int-thick-7-2453355.pdf?src-supplier=Digi-Key; ComponentLink6URL: https://datasheet.ciiva.com/2453/pyu-r-int-thick-7-2453356.pdf?src-supplier=Digi-Key; ComponentLink6Description: https://datasheet.ciiva.com/2453/pyu-r-int-thick-7-2453356.pdf?src-supplier=Digi-Key; ComponentLink7URL: https://datasheet.ciiva.com/2453/pyu-r-int-thick-7-2453357.pdf?src-supplier=Digi-Key; ComponentLink7Description: https://datasheet.ciiva.com/2453/pyu-r-int-thick-7-2453357.pdf?src-supplier=Digi-Key; Supplier 2: Mouser; Supplier Part Number 1: 311-49.9LRCT-ND; Supplier Part Number 2: 603-RC0402FR-0749R9L
R27 = CRCW06030000Z0EA: RES SMD 0 OHM JUMPER 1/10W 0603 0 Ohms Jumper 0.1W, 1/10W Chip Resistor 0603 (1608 Metric) Automotive AEC-Q200 Thick Film; Manufacturer 1: Vishay; Manufacturer Part Number 1: CRCW0603-0000Z0EA; Resistance: 0mR; Power Rating: 100mW; Voltage Rating: 75V; Temperature Coefficient: 100ppm/°C; Tolerance: 5%; Current Rating: 2A; Supplier 1: Digi-Key; Stock 1: 742743; Pricing 1: 1=0.100000, 10=0.034000, 25=0.024400, 50=0.018600, 100=0.013800, 250=0.010480, 500=0.008400, 1000=0.006180 (USD); RoHS: Yes; Mount: Surface Mount; Case/Package: 0603; Weight: 7.1E-05oz; Contact Plating: Tin,Lead; Case Code (Metric): 1608; Case Code (Imperial): 0603; Min Operating Temperature: -55°C; Max Operating Temperature: 155°C; Composition: Thick Film; Termination: SMD/SMT; Packaging: Tape and Reel; Package Quantity: 1; Number of Terminations: 2; Military Standard: Not; Max Power Dissipation: 100mW; Voltage Rating (DC): 75V; Features: Automotive AEC-Q200; Working Voltage: 75V; Length: 1.55mm; Height: 0.02inch; Width: 0.033inch; Depth: 0.85mm; Radiation Hardening: No; Lead Free: Lead Free; REACH SVHC: Unknown; ComponentLink1URL: https://datasheet.ciiva.com/2461/dcrcwe3-2461968.pdf?src-supplier=Digi-Key; ComponentLink1Description: https://datasheet.ciiva.com/2461/dcrcwe3-2461968.pdf?src-supplier=Digi-Key; ComponentLink2URL: https://datasheet.ciiva.com/2461/dcrcwe3-2461969.pdf?src-supplier=Digi-Key; ComponentLink2Description: https://datasheet.ciiva.com/2461/dcrcwe3-2461969.pdf?src-supplier=Digi-Key; ComponentLink3URL: https://datasheet.ciiva.com/2461/dcrcwe3-2461970.pdf?src-supplier=Digi-Key; ComponentLink3Description: https://datasheet.ciiva.com/2461/dcrcwe3-2461970.pdf?src-supplier=Digi-Key; ComponentLink4URL: https://datasheet.ciiva.com/8340/dcrcwe3-8340197.pdf?src-supplier=Avnet; ComponentLink4Description: https://datasheet.ciiva.com/8340/dcrcwe3-8340197.pdf?src-supplier=Avnet; ComponentLink5URL: https://datasheet.ciiva.com/16941/dcrcw-16941302.pdf?src-supplier=Avnet+Europe; ComponentLink5Description: https://datasheet.ciiva.com/16941/dcrcw-16941302.pdf?src-supplier=Avnet+Europe; ComponentLink6URL: https://datasheet.ciiva.com/16199/dcrcwe3-16199063.pdf?src-supplier=Future+Electronics; ComponentLink6Description: https://datasheet.ciiva.com/16199/dcrcwe3-16199063.pdf?src-supplier=Future+Electronics; ComponentLink7URL: https://datasheet.ciiva.com/16725/70201119-16725175.pdf?src-supplier=Allied+Electronics; ComponentLink7Description: https://datasheet.ciiva.com/16725/70201119-16725175.pdf?src-supplier=Allied+Electronics; ComponentLink8URL: https://datasheet.ciiva.com/26316/fld-crcw-e3-data-en-26316615.pdf?src-supplier=Distrelec; ComponentLink8Description: https://datasheet.ciiva.com/26316/fld-crcw-e3-data-en-26316615.pdf?src-supplier=Distrelec; ComponentLink9URL: https://datasheet.ciiva.com/5544/dcrcwe3-109170-5544344.pdf?src-supplier=Mouser; ComponentLink9Description: https://datasheet.ciiva.com/5544/dcrcwe3-109170-5544344.pdf?src-supplier=Mouser; ComponentLink10URL: https://datasheet.ciiva.com/7841/1720486-7841816.pdf?src-supplier=Element14; ComponentLink10Description: https://datasheet.ciiva.com/7841/1720486-7841816.pdf?src-supplier=Element14; ComponentLink11URL: https://datasheet.ciiva.com/7841/1720486-7841817.pdf?src-supplier=Element14; ComponentLink11Description: https://datasheet.ciiva.com/7841/1720486-7841817.pdf?src-supplier=Element14; ComponentLink12URL: https://datasheet.ciiva.com/7841/125364-7841818.pdf?src-supplier=Element14; ComponentLink12Description: https://datasheet.ciiva.com/7841/125364-7841818.pdf?src-supplier=Element14; ComponentLink13URL: https://datasheet.ciiva.com/16721/70201119-16721450.pdf?src-supplier=Allied+Electronics; ComponentLink13Description: https://datasheet.ciiva.com/16721/70201119-16721450.pdf?src-supplier=Allied+Electronics; Supplier Part Number 1: 541-0.0GCT-ND
R78 = RC0402FR-1310KL: RES SMD 10K OHM 1% 0402 1/16W Chip Resistor, 0402 [1005 Metric], 10 kohm, RC Series, 50 V, Thick Film, 62.5 mW; Manufacturer 1: Yageo; Resistance: 10kR; Temperature Coefficient: 100ppm/°C; Power Rating: 62.5mW; Voltage Rating: 50V; ComponentLink1URL: https://datasheet.ciiva.com/16940/pyu-rc0402-51-rohs-l-6-16940293.pdf?src-supplier=Avnet+Europe; ComponentLink1Description: https://datasheet.ciiva.com/16940/pyu-rc0402-51-rohs-l-6-16940293.pdf?src-supplier=Avnet+Europe; ComponentLink2URL: https://datasheet.ciiva.com/28386/pyu-rc0402-51-rohs-l-6-28386855.pdf?src-supplier=Avnet+Europe; ComponentLink2Description: https://datasheet.ciiva.com/28386/pyu-rc0402-51-rohs-l-6-28386855.pdf?src-supplier=Avnet+Europe; ComponentLink3URL: https://datasheet.ciiva.com/16740/pyu-rc0402-51-rohs-l-6-r-16740602.pdf?src-supplier=Future+Electronics; ComponentLink3Description: https://datasheet.ciiva.com/16740/pyu-rc0402-51-rohs-l-6-r-16740602.pdf?src-supplier=Future+Electronics; ComponentLink4URL: https://datasheet.ciiva.com/8891/pyu-rc0402-51-rohs-l-6-8891339.pdf?src-supplier=Avnet; ComponentLink4Description: https://datasheet.ciiva.com/8891/pyu-rc0402-51-rohs-l-6-8891339.pdf?src-supplier=Avnet; ComponentLink5URL: https://datasheet.ciiva.com/5557/pyu-rc0402-51-rohs-l-6-r-5557997.pdf?src-supplier=Mouser; ComponentLink5Description: https://datasheet.ciiva.com/5557/pyu-rc0402-51-rohs-l-6-r-5557997.pdf?src-supplier=Mouser; ComponentLink6URL: https://datasheet.ciiva.com/7983/1018594-7983533.pdf?src-supplier=Element14; ComponentLink6Description: https://datasheet.ciiva.com/7983/1018594-7983533.pdf?src-supplier=Element14; Supplier 1: Newark; Manufacturer Part Number 1: RC0402FR-1310KL; Stock 1: 62239; Pricing 1: 1=0.10000, 25=0.01200, 100=0.00400, 250=0.00400, 500=0.00300, 1000=0.00300 (USD); RoHS: Yes; Case/Package: 0402; Number of Pins: 2; Contact Plating: Tin,Matte,Lead; Case Code (Imperial): 0402; Case Code (Metric): 1005; Min Operating Temperature: -55°C; Max Operating Temperature: 155°C; Tolerance: 1%; Composition: Thick Film; Packaging: Tape and Reel; Termination: SMD/SMT; Military Standard: Not; Voltage Rating (DC): 50V; Working Voltage: 50V; Number of Terminations: 2; Length: 1mm; Depth: 0.5mm; Radiation Hardening: No; REACH SVHC: No SVHC; Lead Free: Lead Free; Supplier Part Number 1: 67R9960; Supplier 2: Future Electronics; Supplier 3: Mouser; Supplier 4: Element14; Supplier Part Number 2: RC0402FR-1310KL-CUTT; Supplier Part Number 3: 603-RC0402FR-1310KL; Supplier Part Number 4: 1799235
U11 = NC7SZ66M5X: ANALOGUE SWITCH, SINGLE, SPST-NO, SOT-23; Analog Switch Type:SPST - NO; No. of Channels:1; On State Resistance Max:60ohm; Supply Voltage Range:1.65V to 5.5V; Analog Switch Case:SOT-23; No. of Pins:5; Operating Temperature Min:-40 C ;RoHS Compliant: Yes; Manufacturer 1: ON Semiconductor / Fairchild; Min Supply Voltage: 1.65V; Max Power Dissipation: 200mW; On-State Resistance: 5R; Turn-On Delay Time: 7ns; Turn-Off Delay Time: 9.2ns; Number of Channels: 1; Max Supply Current: 10uA; Throw Configuration: SPST; High Level Output Current: 128mA; Quiescent Current: 50nA; Polarity: Non-Inverting; Voltage: 5V; Supplier 1: Digi-Key; Manufacturer Part Number 1: NC7SZ66M5X; RoHS: Yes; Category: Decoders and Multiplexers; Stock 1: 12120; Pricing 1: 1=0.39000, 10=0.32000, 25=0.29280, 100=0.21780, 250=0.19736, 500=0.16332, 1000=0.12249 (USD); Mount: Surface Mount; Case/Package: SOT-23-5; Number of Pins: 5; Weight: 0.001058oz; Contact Plating: Tin,Matte; Min Operating Temperature: -40°C; Max Operating Temperature: 85°C; Packaging: Tape and Reel; Max Supply Voltage: 5.5V; Package Quantity: 1; Supply Type: Single; Number of Inputs: 1; Number of Outputs: 1; Independent Circuits: 1; Power Dissipation: 200mW; Number of Circuits: 1; Number of Bits: 1; Length: 3mm; Width: 1.7mm; Height: 1.3mm; Radiation Hardening: No; RoHS Compliant: Yes; Lead Free: Lead Free; REACH SVHC: No SVHC; ComponentLink1URL: https://datasheet.ciiva.com/4917/nc7sz66-98769-4917648.pdf?src-supplier=Mouser; ComponentLink1Description: https://datasheet.ciiva.com/4917/nc7sz66-98769-4917648.pdf?src-supplier=Mouser; ComponentLink2URL: https://datasheet.ciiva.com/15127/getdatasheetpartid-142529-15127273.pdf?src-supplier=Verical; ComponentLink2Description: https://datasheet.ciiva.com/15127/getdatasheetpartid-142529-15127273.pdf?src-supplier=Verical; ComponentLink3URL: https://datasheet.ciiva.com/34301/1021815-34301882.pdf?src-supplier=Jameco; ComponentLink3Description: https://datasheet.ciiva.com/34301/1021815-34301882.pdf?src-supplier=Jameco; ComponentLink4URL: https://datasheet.ciiva.com/1514/1751945-1514528.pdf?src-supplier=Element14; ComponentLink4Description: https://datasheet.ciiva.com/1514/1751945-1514528.pdf?src-supplier=Element14; ComponentLink5URL: https://datasheet.ciiva.com/2980/nc7sz66-2980326.pdf?src-supplier=Avnet; ComponentLink5Description: https://datasheet.ciiva.com/2980/nc7sz66-2980326.pdf?src-supplier=Avnet; ComponentLink6URL: https://datasheet.ciiva.com/26240/nc7sz66-26240518.pdf?src-supplier=Avnet+Europe; ComponentLink6Description: https://datasheet.ciiva.com/26240/nc7sz66-26240518.pdf?src-supplier=Avnet+Europe; ComponentLink7URL: https://datasheet.ciiva.com/1888/nc7sz66-1888140.pdf?src-supplier=Digi-Key; ComponentLink7Description: https://datasheet.ciiva.com/1888/nc7sz66-1888140.pdf?src-supplier=Digi-Key; ComponentLink8URL: https://datasheet.ciiva.com/1888/nc7sz66-1888141.pdf?src-supplier=Digi-Key; ComponentLink8Description: https://datasheet.ciiva.com/1888/nc7sz66-1888141.pdf?src-supplier=Digi-Key; ComponentLink9URL: https://datasheet.ciiva.com/1888/nc7sz66-1888142.pdf?src-supplier=Digi-Key; ComponentLink9Description: https://datasheet.ciiva.com/1888/nc7sz66-1888142.pdf?src-supplier=Digi-Key